# Altium schematic sheet Sheet1.SchDoc
size A; SheetNumber: 1; SheetTotal: 6
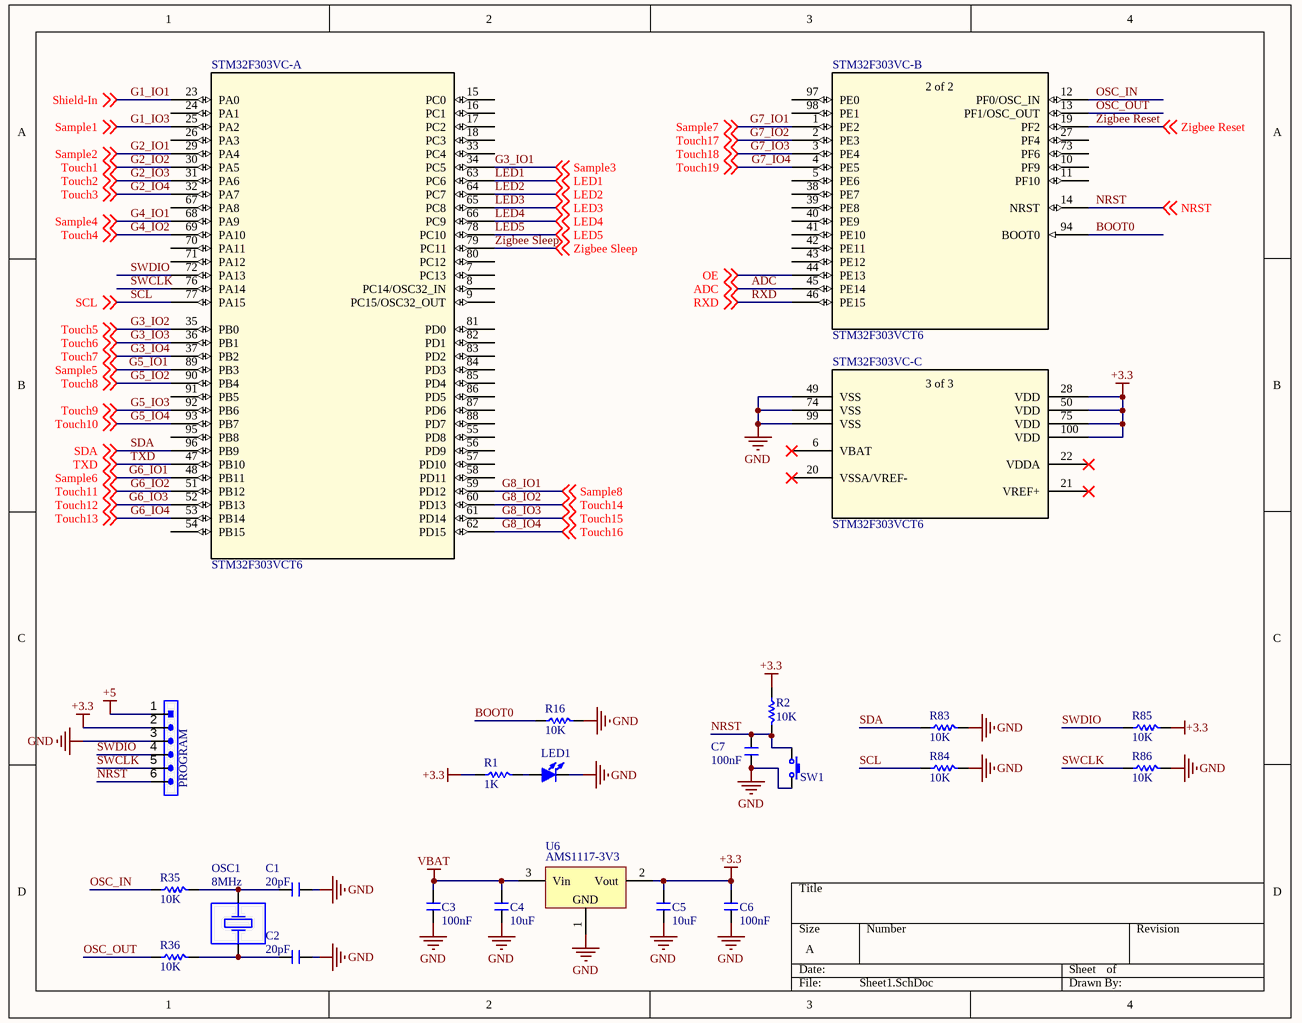
[diagram p0: Sheet1.SchDoc]

## Parts
C1  20pF  [C 0805]
C2  20pF  [C 0805]
C3  100nF  [C 0805]
C4  10uF  [C 0805]
C5  10uF  [C 0805]
C6  100nF  [C 0805]
C7  100nF  [C 0805]
LED1  LED-SMD  [LED 0805R]  (value not drawn)
OSC1  8MHz  [XTAL-HC49S-THD]
PROGRAM  HDR-1X6  [HDR-1X6]  (value not drawn)
R1  1K  [R 0805]
R2  10K  [R 0805]
R16  10K  [R 0805]
R35  10K  [R 0805]
R36  10K  [R 0805]
R83  10K  [R 0805]
R84  10K  [R 0805]
R85  10K  [R 0805]
R86  10K  [R 0805]
STM32F303VC-  STM32F303VCT6  [LQFP100_STM]  (parts A,B,C of 3)
SW1  3x6x5  [TSW SMD-3*6*2.5]  (value not drawn)
U6  AMS1117-3V3  [SOT223_L]

## Nets
+3.3: C5.2 C6.2 PROGRAM.2 R1.1 R2.1 R85.2 STM32F303VC-.28(VDD) STM32F303VC-.50(VDD) STM32F303VC-.75(VDD) STM32F303VC-.100(VDD) U6.2(Vout)
+5: PROGRAM.1
GND: C1.1 C2.1 C3.1 C4.1 C5.1 C6.1 C7.1 LED1.2(K) PROGRAM.3 R16.2 R83.2 R84.2 R86.2 STM32F303VC-.49(VSS) STM32F303VC-.74(VSS) STM32F303VC-.99(VSS) SW1.2 U6.1(GND)
VBAT: C3.2 C4.2 U6.3(Vin)
ADC: STM32F303VC-.45(PE14) ; off-sheet ADC
BOOT0: R16.1 STM32F303VC-.94(BOOT0)
G1_IO1: STM32F303VC-.23(PA0) ; off-sheet Shield-In  [also labelled Shield-In]
G1_IO3: STM32F303VC-.25(PA2) ; off-sheet Sample1  [also labelled Sample1]
G2_IO1: STM32F303VC-.29(PA4) ; off-sheet Sample2  [also labelled Sample2]
G2_IO2: STM32F303VC-.30(PA5) ; off-sheet Touch1  [also labelled Touch1]
G2_IO3: STM32F303VC-.31(PA6) ; off-sheet Touch2  [also labelled Touch2]
G2_IO4: STM32F303VC-.32(PA7) ; off-sheet Touch3  [also labelled Touch3]
G3_IO1: STM32F303VC-.34(PC5) ; off-sheet Sample3  [also labelled Sample3]
G3_IO2: STM32F303VC-.35(PB0) ; off-sheet Touch5  [also labelled Touch5]
G3_IO3: STM32F303VC-.36(PB1) ; off-sheet Touch6  [also labelled Touch6]
G3_IO4: STM32F303VC-.37(PB2) ; off-sheet Touch7  [also labelled Touch7]
G4_IO1: STM32F303VC-.68(PA9) ; off-sheet Sample4  [also labelled Sample4]
G4_IO2: STM32F303VC-.69(PA10) ; off-sheet Touch4  [also labelled Touch4]
G5_IO1: STM32F303VC-.89(PB3) ; off-sheet Sample5  [also labelled Sample5]
G5_IO2: STM32F303VC-.90(PB4) ; off-sheet Touch8  [also labelled Touch8]
G5_IO3: STM32F303VC-.92(PB6) ; off-sheet Touch9  [also labelled Touch9]
G5_IO4: STM32F303VC-.93(PB7) ; off-sheet Touch10  [also labelled Touch10]
G6_IO1: STM32F303VC-.48(PB11) ; off-sheet Sample6  [also labelled Sample6]
G6_IO2: STM32F303VC-.51(PB12) ; off-sheet Touch11  [also labelled Touch11]
G6_IO3: STM32F303VC-.52(PB13) ; off-sheet Touch12  [also labelled Touch12]
G6_IO4: STM32F303VC-.53(PB14) ; off-sheet Touch13  [also labelled Touch13]
G7_IO1: STM32F303VC-.1(PE2) ; off-sheet Sample7  [also labelled Sample7]
G7_IO2: STM32F303VC-.2(PE3) ; off-sheet Touch17  [also labelled Touch17]
G7_IO3: STM32F303VC-.3(PE4) ; off-sheet Touch18  [also labelled Touch18]
G7_IO4: STM32F303VC-.4(PE5) ; off-sheet Touch19  [also labelled Touch19]
G8_IO1: STM32F303VC-.59(PD12) ; off-sheet Sample8  [also labelled Sample8]
G8_IO2: STM32F303VC-.60(PD13) ; off-sheet Touch14  [also labelled Touch14]
G8_IO3: STM32F303VC-.61(PD14) ; off-sheet Touch15  [also labelled Touch15]
G8_IO4: STM32F303VC-.62(PD15) ; off-sheet Touch16  [also labelled Touch16]
LED1: STM32F303VC-.63(PC6) ; off-sheet LED1
LED2: STM32F303VC-.64(PC7) ; off-sheet LED2
LED3: STM32F303VC-.65(PC8) ; off-sheet LED3
LED4: STM32F303VC-.66(PC9) ; off-sheet LED4
LED5: STM32F303VC-.78(PC10) ; off-sheet LED5
NRST: C7.2 PROGRAM.6 R2.2 STM32F303VC-.14(NRST) SW1.1 ; off-sheet NRST
OE: STM32F303VC-.44(PE13) ; off-sheet OE
OSC_IN: R35.1 STM32F303VC-.12(PF0/OSC_IN)
OSC_OUT: R36.1 STM32F303VC-.13(PF1/OSC_OUT)
RXD: STM32F303VC-.46(PE15) ; off-sheet RXD
SCL: R84.1 STM32F303VC-.77(PA15) ; off-sheet SCL
SDA: R83.1 STM32F303VC-.96(PB9) ; off-sheet SDA
SWCLK: PROGRAM.5 R86.1 STM32F303VC-.76(PA14)
SWDIO: PROGRAM.4 R85.1 STM32F303VC-.72(PA13)
TXD: STM32F303VC-.47(PB10) ; off-sheet TXD
Zigbee Reset: STM32F303VC-.19(PF2) ; off-sheet Zigbee Reset
Zigbee Sleep: STM32F303VC-.79(PC11) ; off-sheet Zigbee Sleep
NetC1_2: C1.2 OSC1.2 R35.2
NetC2_2: C2.2 OSC1.1 R36.2
NetLED1_1: LED1.1(A) R1.2

Not connected (* = marked no-connect by the designer): STM32F303VC- 5(PE6) 6(VBAT)* 7(PC13) 8(PC14/OSC32_IN) 9(PC15/OSC32_OUT) 10(PF9) 11(PF10) 15(PC0) 16(PC1) 17(PC2) 18(PC3) 20(VSSA/VREF-)* 21(VREF+)* 22(VDDA)* 24(PA1) 26(PA3) 27(PF4) 33(PC4) 38(PE7) 39(PE8) 40(PE9) 41(PE10) 42(PE11) 43(PE12) 54(PB15) 55(PD8) 56(PD9) 57(PD10) 58(PD11) 67(PA8) 70(PA11) 71(PA12) 73(PF6) 80(PC12) 81(PD0) 82(PD1) 83(PD2) 84(PD3) 85(PD4) 86(PD5) 87(PD6) 88(PD7) 91(PB5) 95(PB8) 97(PE0) 98(PE1)

## Notes on the sheet
- (in symbol STM32F303VCT6, part B) 2 of 2
- (in symbol STM32F303VCT6, part C) 3 of 3

## Library data of the parts
C1-C7 = C: Non-polar patch capacitor; BOM名称: 无极性贴片电容; 版权归属: 源创客; 学习资源: www.ooocke.com
LED1 = LED-SMD: Patch LED; BOM名称: 贴片LED; 版权归属: 源创客; 学习资源: www.ooocke.com
OSC1 = XTAL-2: 2-Pin crystal; BOM名称: 2脚晶振; 版权归属: 源创客; 学习资源: www.ooocke.com
PROGRAM = Header 6: 6P Connector; BOM名称: 6P接插件; 版权归属: 源创客; 学习资源: www.ooocke.com
R1 R2 R16 R35 R36 R83-R86 = R: Chip resistor; 版权归属: 源创客; BOM名称: Chip resistor; 学习资源: www.ooocke.com
STM32F303VC- = STM32F303VCT6: No Description Available; Built_By: EMA_Jessica; Vendor: STMicroelectronics; SourceLibrary: Updates_to_database_2020-11-10; Copyright: Copyright (C) 2018 Accelerated Designs. All rights reserved; Manufacturer_Part_Number: STM32F303VCT6; RefDes: RefDes; Type: DEV
SW1 = TSW 3x6: 3x6 tact switch; BOM名称: 3x6轻触开关; 版权归属: 源创客; 学习资源: www.ooocke.com
U6 = AMS1117: Three-terminal regulator chip; BOM名称: 稳压芯片; 版权归属: 源创客; 学习资源: www.ooocke.com